# EAGLE design test_board (EAGLE 8.0.0)
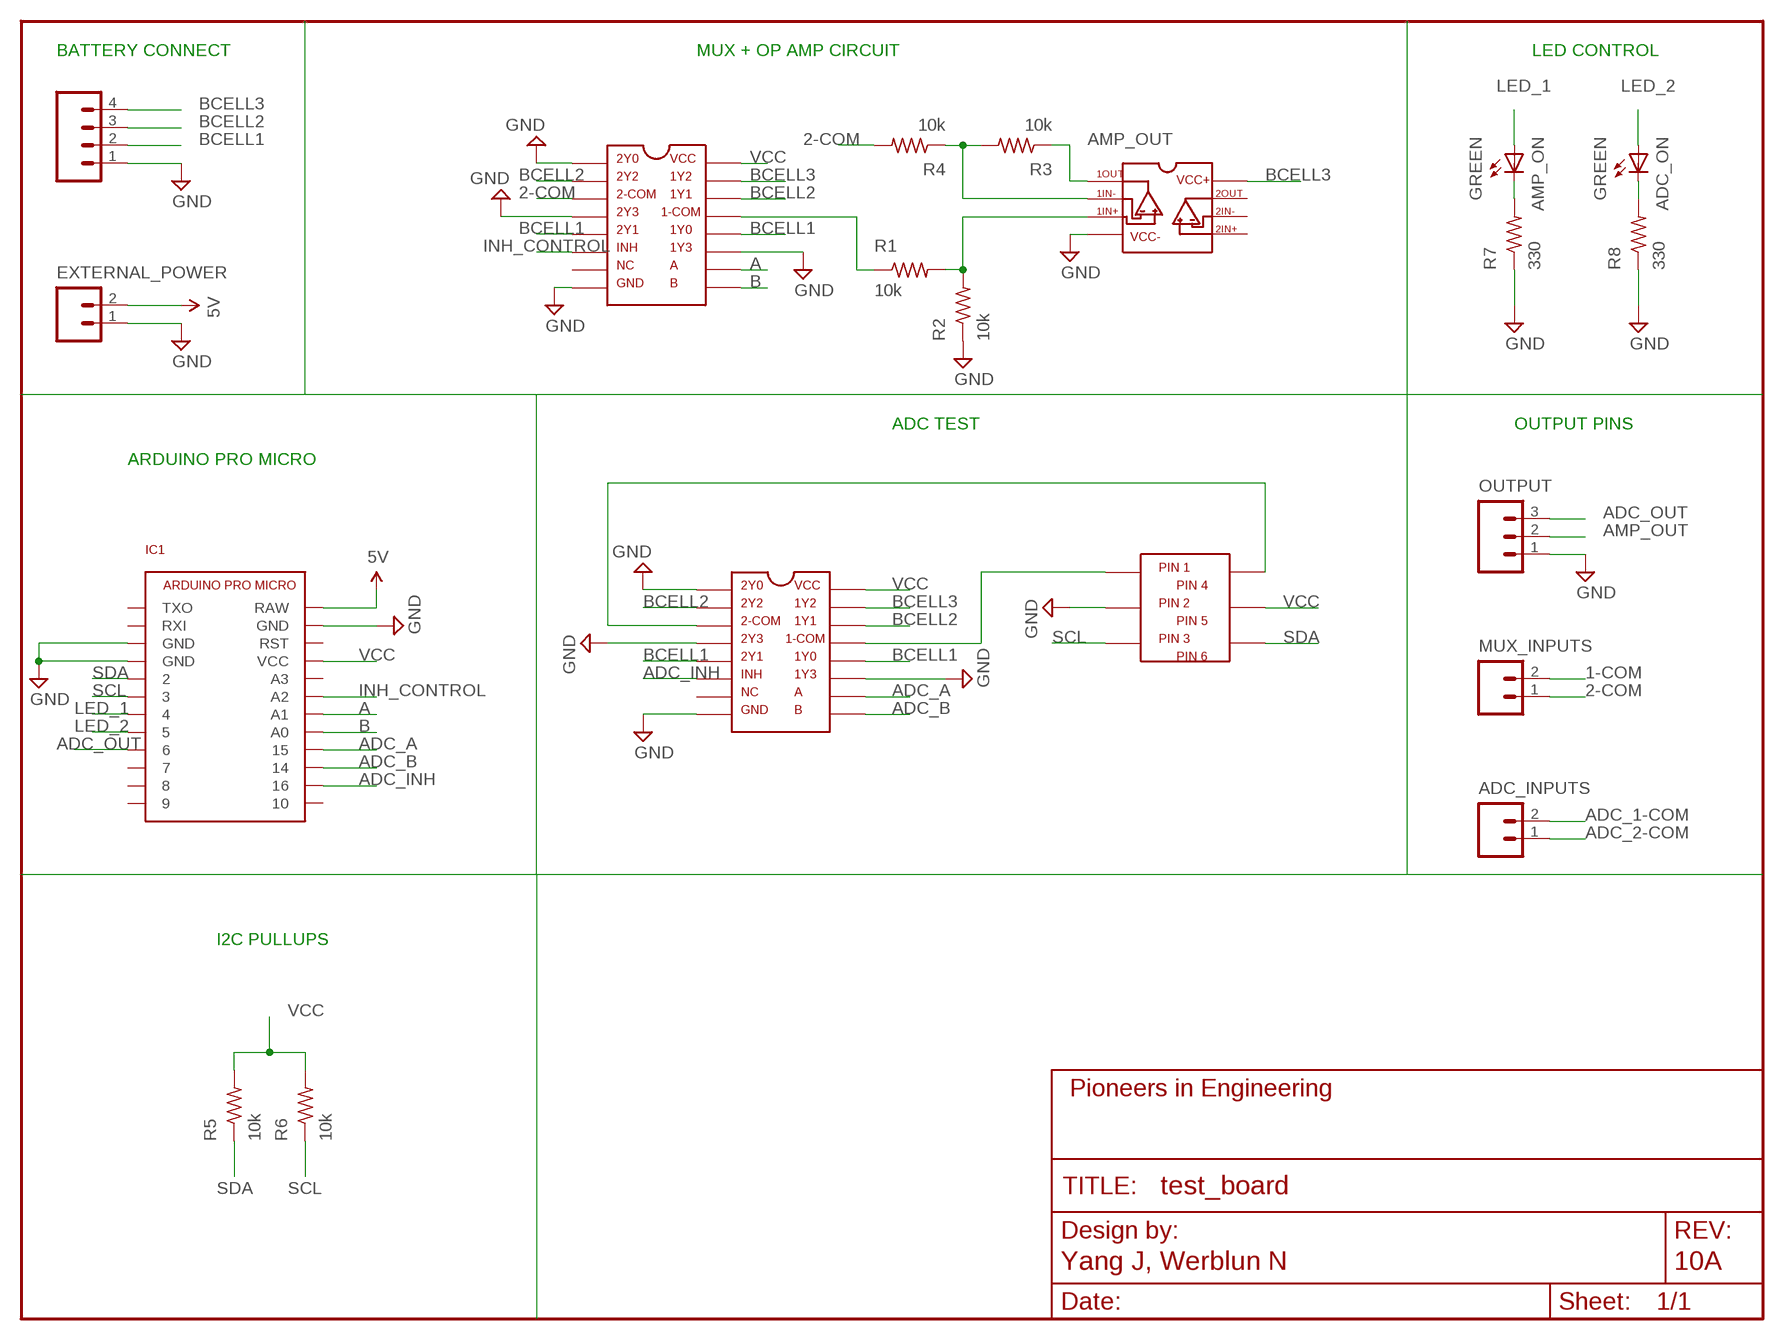
[diagram p0: schematic, sheet 1]
FRAME1 (FRAME_SCHEMATIC): AUTHOR: Yang J, Werblun N; REVISION: 10A

## Parts
ADC_INPUTS  M02PTH  [1X02]
ADC_ON  GREEN  LED0603  [LED-0603]
AMP_ON  GREEN  LED0603  [LED-0603]
BATTERY_CONNECT  XH_CONNECTOR_4POS  [XH_CONNECTOR_4POS_2.5MM]
EXTERNAL_POWER  M02PTH  [1X02]
IC1  ARDUINO_PRO_MICRO  [ARDUINO_PRO_MICRO]
MUX_INPUTS  M02PTH  [1X02]
OUTPUT  M03PTH  [1X03]
R1  10k  R-US_R0603  [R0603]
R2  10k  R-US_R0603  [R0603]
R3  10k  R-US_R0603  [R0603]
R4  10k  R-US_R0603  [R0603]
R5  10k  R-US_R0603  [R0603]
R6  10k  R-US_R0603  [R0603]
R7  330  R-US_R0603  [R0603]
R8  330  R-US_R0603  [R0603]
U$1  SN74HC4852  [DIL16]
U$2  TL072  [DIL08]
U$3  SOT-23_6PIN  [SOT-23_6PIN]
U$5  SN74HC4852  [DIL16]

## Nets
1-COM: MUX_INPUTS.2 R1.1 U$1.13(1-COM)
2-COM: MUX_INPUTS.1 R4.2 U$1.3(2-COM)
5V: EXTERNAL_POWER.2 IC1.RAW
A: IC1.A1 U$1.10(A)
ADC_1-COM: ADC_INPUTS.2 U$3.P$1 U$5.13(1-COM)
ADC_2-COM: ADC_INPUTS.1 U$3.P$4 U$5.3(2-COM)
ADC_A: IC1.15 U$5.10(A)
ADC_B: IC1.14 U$5.9(B)
ADC_INH: IC1.16 U$5.6(INH)
ADC_OUT: IC1.6 OUTPUT.3
AMP_OUT: OUTPUT.2 R3.1 U$2.1(1OUT)
B: IC1.A0 U$1.9(B)
BCELL1: BATTERY_CONNECT.2 U$1.5(2Y1) U$1.12(1Y0) U$5.5(2Y1) U$5.12(1Y0)
BCELL2: BATTERY_CONNECT.3 U$1.2(2Y2) U$1.14(1Y1) U$5.2(2Y2) U$5.14(1Y1)
BCELL3: BATTERY_CONNECT.4 U$1.15(1Y2) U$2.8(VCC+) U$5.15(1Y2)
GND: BATTERY_CONNECT.1 EXTERNAL_POWER.1 IC1.GND@0(GND) IC1.GND@1(GND) IC1.GND@2(GND) OUTPUT.1 R2.1 R7.1 R8.1 U$1.1(2Y0) U$1.4(2Y3) U$1.8(GND) U$1.11(1Y3) U$2.4(VCC-) U$3.P$2 U$5.1(2Y0) U$5.4(2Y3) U$5.8(GND) U$5.11(1Y3)
INH_CONTROL: IC1.A2 U$1.6(INH)
LED_1: AMP_ON.A IC1.4
LED_2: ADC_ON.A IC1.5
N$2: R1.2 R2.2 U$2.3(1IN+)
N$3: R3.2 R4.1 U$2.2(1IN-)
N$7: ADC_ON.C R8.2
N$8: AMP_ON.C R7.2
SCL: IC1.3 R6.1 U$3.P$3
SDA: IC1.2 R5.1 U$3.P$6
VCC: IC1.VCC R5.2 R6.2 U$1.16(VCC) U$3.P$5 U$5.16(VCC)
Unconnected: IC1.7 IC1.8 IC1.9 IC1.10 IC1.A3 IC1.RST IC1.RXI IC1.TXO U$1.7(NC) U$2.5(2IN+) U$2.6(2IN-) U$2.7(2OUT) U$5.7(NC)

## Notes on the sheet
- BATTERY CONNECT | MUX + OP AMP CIRCUIT | LED CONTROL
- ADC TEST | OUTPUT PINS
- ARDUINO PRO MICRO
- I2C PULLUPS

## Library data of the parts
ADC_INPUTS EXTERNAL_POWER MUX_INPUTS = pie:M02: 2-pin 0.1-inch header and MTA connector; PIE-INT-REF-NUM: BULK-STOCK
ADC_ON AMP_ON = pie:LED: LEDs Standard schematic elements and footprints for 5mm, 3mm, 1206, and 0603 sized LEDs. 5mm - Spark Fun Electronics SKU : COM-00529 (and others); DESCRIPTION: LEDs; DISTRIBUTOR: DigiKey; DISTRIBUTOR_PART_NUMBER: 160-1415-1-ND; MANUFACTURER: Lite-On Inc; MANUFACTURER_PART_NUMBER: LTST-C170KRKT; PACKAGE: LED0603; VALUE: COLOR
BATTERY_CONNECT = pie:XH_CONNECTOR_4POS: 4-pin XH connector (through-hole type shrouded header); PIE-INT-REF-NUM: XH-4POS; PIE_DIGIKEY-PN: 455-2249-ND
IC1 = pie:ARDUINO_PRO_MICRO: Arduino Pro Micro Electrical System Year 9's Smart Sensor Core Pin Outs <https://cdn.sparkfun.com/assets/9/c/3/c/4/523a1765757b7f5c6e8b4567.png> Buy Here <http://www.aliexpress.com/item/Mini-Leonardo-Pro-Micro-ATmega32U4-5V-16MHz-Module-For-Arduino-Best-Quality/32284746884.html?ws_ab_test=searchweb201556_8,searchweb201602_2_10057_10056_10065_10055_10054_10067_10069_10059_10058_10017_10070_10060_10061_10052_10062_10053_10050_10051,searchweb201603_1&btsid=45993952-29ca-4de4-a0fb-c7fb72b8e1a5> Thru Hole Female Pins <http://www.digikey.com/product-search/en?keywords=929974E-01-12-ND> Surface Mount Female Pins <http://www.digikey.com/product-detail/en/sullins-connector-solutions/NPTC121KFXC-RC/S5604-ND/776062>; DESCRIPTION: Arduino Pro Micro; DISTRIBUTOR: AliExpress; DISTRIBUTOR_PART_NUMBER: 32284746884; MANUFACTURER: Feiyang electronics; NOTES: https://www.aliexpress.com/item/Mini-Leonardo-Pro-Micro-ATmega32U4-5V-16MHz-Module-For-Arduino-Best-Quality/32284746884.html?ws_ab_test=searchweb201556_8,searchweb201602_2_10057_10056_10065_10055_10054_10067_10069_10059_10058_10017_10070_10060_10061_10052_10062_10053_10050_10051,searchweb201603_1&btsid=45993952-29ca-4de4-a0fb-c7fb72b8e1a5; PACKAGE: ARDUINO_PRO_MICRO; REFERENCE_DEST: ARDUINO_PRO_MICRO
OUTPUT = pie:M03: 3-pin 0.1-inch header and MTA connector; PIE-INT-REF-NUM: BULK-STOCK
R1-R8 = pie:R-US_: RESISTOR, American symbol; DESCRIPTION: RESISTOR, American symbol; DISTRIBUTOR: DigiKey; MANUFACTURER: Rohm Semiconductor; NOTES: Cut Tape; PACKAGE: R0603; VALUE: >VALUE
U$1 U$5 = pie:SN74HC4852
U$2 = pie:TL072
U$3 = pie:SOT-23_6PIN

## Board
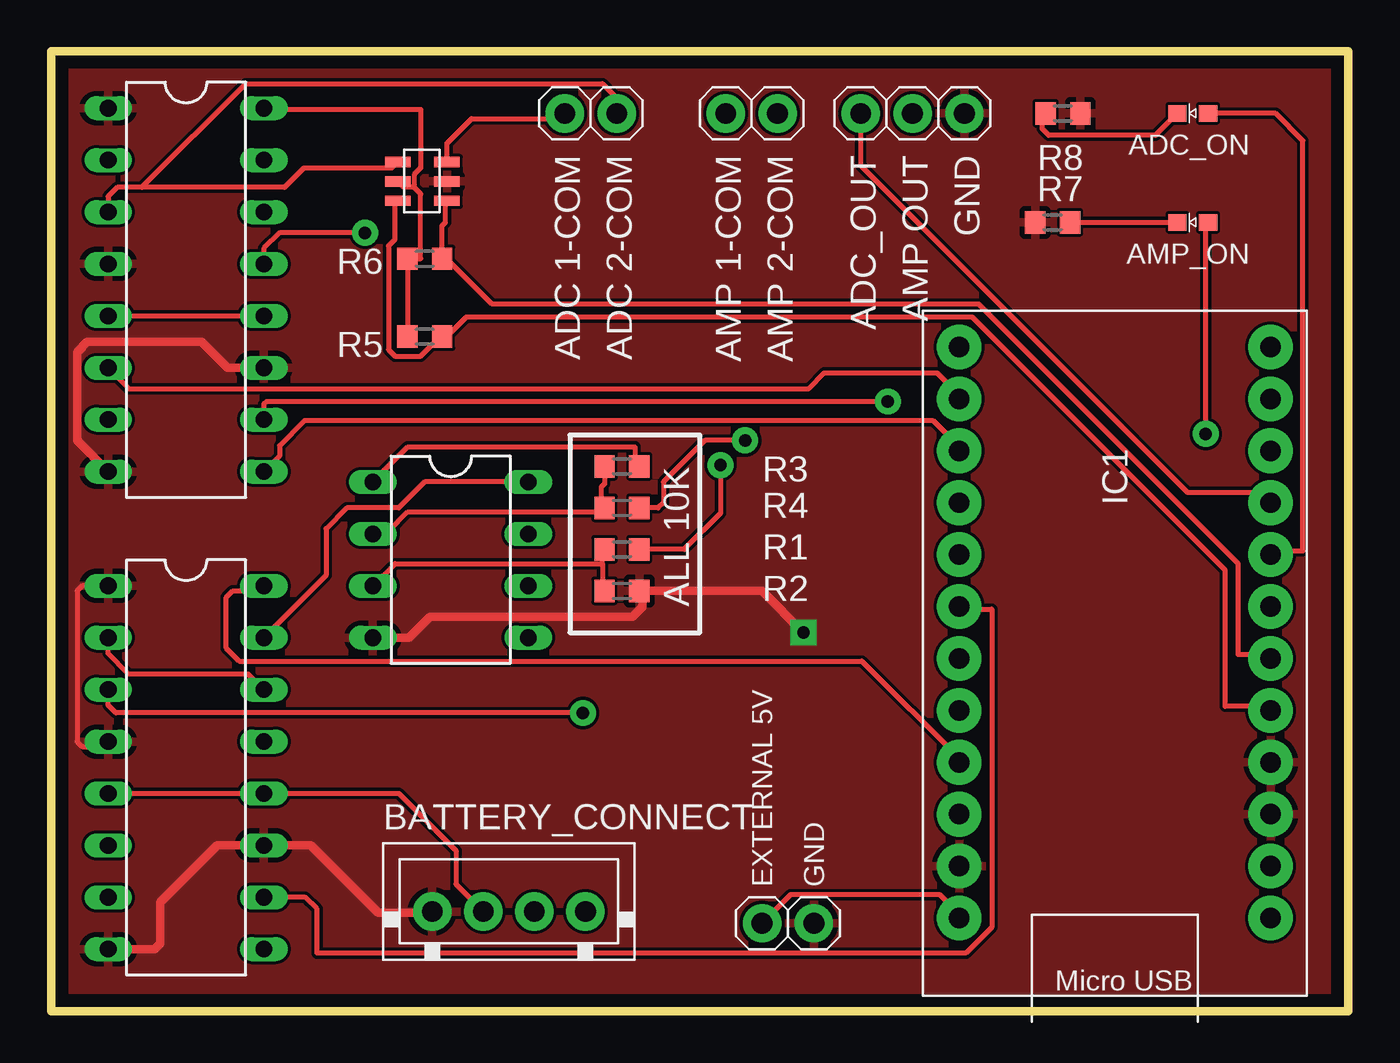
[diagram p1: board, top side]
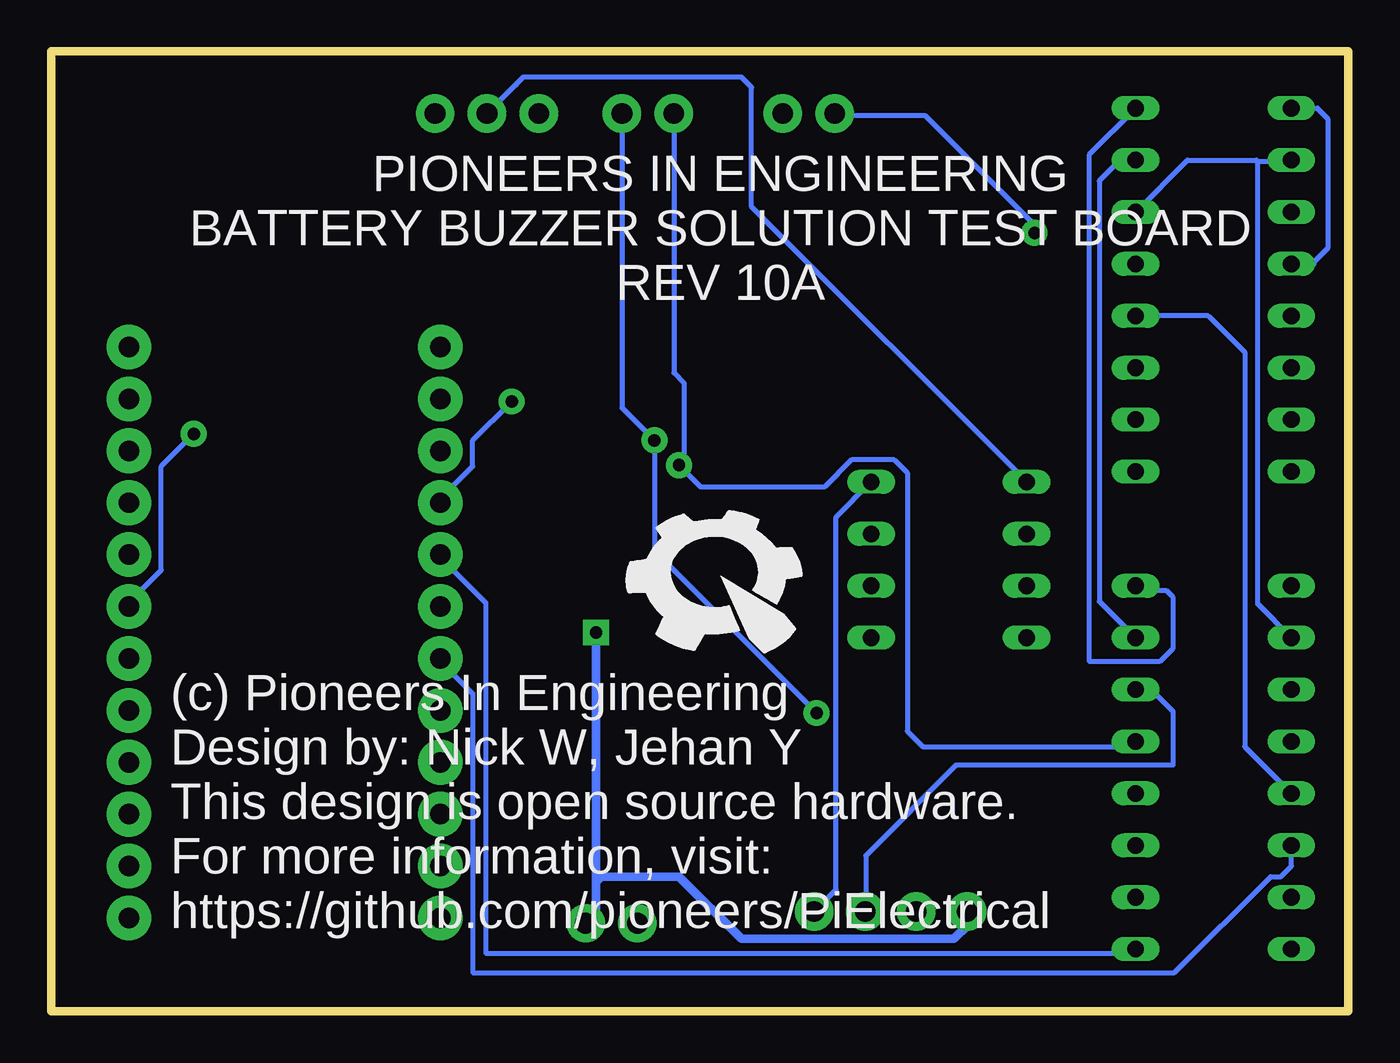
[diagram p2: board, bottom side, seen from below]

Size 63.5 x 46.99 mm. Coordinates in mm from the lower left corner, seen from the top.
Outline: 0,0 63.5,0 63.5,46.99 0,46.99 0,0
Copper layers (1*16): Top 2mil / dielectric 9mil / Bottom 2mil
Design rules "pie": minimum track width 6mil, minimum drill 15mil, track to track 6mil, track to pad 6mil, pad to pad 6mil, via to via 6mil, smd to smd 6mil, copper to edge 25mil, drill to drill 7mil, minimum pad ring 7mil, minimum via ring 7mil, stop-mask expansion 3mil, vias tented up to drill 21mil, thermal gap 10mil

### Footprints (pad centres in the part's own frame; a part is rotated, then mirrored left to right if it is on the bottom)
1X02 = drill 1.016 pad 1.88: 1 -1.27,0; 2 1.27,0
LED-0603 = smd 0.8 x 0.889: A 0,-0.75; C 0,0.75
XH_CONNECTOR_4POS_2.5MM = drill 1.016 pad 1.88: 1 -3.95,-0.19; 2 -1.45,-0.19; 3 1.05,-0.19; 4 3.55,-0.19
ARDUINO_PRO_MICRO = drill 1 pad 2.184: 2 1.778,19.558; 3 1.778,17.018; 4 1.778,14.478; 5 1.778,11.938; 6 1.778,9.398; 7 1.778,6.858; 8 1.778,4.318; 9 1.778,1.778; 10 17.018,1.778; 14 17.018,6.858; 15 17.018,9.398; 16 17.018,4.318; A0 17.018,11.938; A1 17.018,14.478; A2 17.018,17.018; A3 17.018,19.558; GND@0 1.778,24.638; GND@1 1.778,22.098; GND@2 17.018,27.178; RAW 17.018,29.718; RST 17.018,24.638; RXI 1.778,27.178; TXO 1.778,29.718; VCC 17.018,22.098
1X03 = drill 1.016 pad 1.88: 1 -2.54,0; 2 0,0; 3 2.54,0
R0603 = smd 1 x 1.1: 1 -0.85,0; 2 0.85,0
DIL16 = drill 0.813 long: 1 -8.89,-3.81; 2 -6.35,-3.81; 3 -3.81,-3.81; 4 -1.27,-3.81; 5 1.27,-3.81; 6 3.81,-3.81; 7 6.35,-3.81; 8 8.89,-3.81; 9 8.89,3.81; 10 6.35,3.81; 11 3.81,3.81; 12 1.27,3.81; 13 -1.27,3.81; 14 -3.81,3.81; 15 -6.35,3.81; 16 -8.89,3.81
DIL08 = drill 0.813 long: 1 -3.81,-3.81; 2 -1.27,-3.81; 3 1.27,-3.81; 4 3.81,-3.81; 5 3.81,3.81; 6 1.27,3.81; 7 -1.27,3.81; 8 -3.81,3.81
SOT-23_6PIN = smd 0.5 x 1.25: P$1 0.6,2.1; P$2 1.55,2.1; P$3 2.5,2.1; P$4 0.6,-0.3; P$5 1.55,-0.3; P$6 2.5,-0.3

### Placement (x,y rotation side)
ADC_INPUTS  26.42,43.94 180 top
ADC_ON  55.88,43.94 90 top
AMP_ON  55.88,38.61 90 top
BATTERY_CONNECT  22.61,5.08 0 top
EXTERNAL_POWER  36.07,4.32 180 top
IC1  61.47,34.29 180 top
MUX_INPUTS  34.29,43.94 180 top
OUTPUT  42.16,43.94 180 top
R1  27.94,22.61 180 top
R2  27.94,20.57 180 top
R3  27.94,26.67 180 top
R4  27.94,24.64 0 top
R5  18.29,33.02 180 top
R6  18.29,36.83 180 top
R7  49.02,38.61 0 top
R8  49.53,43.94 180 top
U$1  6.6,11.94 270 top
U$2  19.56,22.1 270 top
U$3  17.27,42.16 270 top
U$5  6.6,35.31 270 top
U$7  [PIE-LOGO-SMALL]  30.73,21.34 0 bottom

### Tracks (layer width: path | path; a pad name or v marks a point on that pad's centre or on a via)
1-COM  (via drill 0.61 pad 1.27)
  Top 0.254: v32.77,26.73 32.77,24.38 30.99,22.61 R1.1
  Bottom 0.254: MUX_INPUTS.2 33.02,31.24 32.51,30.73 32.51,26.99 v32.77,26.73 31.69,25.65 25.65,25.65 24.32,26.99 22.23,26.99 21.59,26.35 21.59,13.72 20.83,12.95 10.67,12.95 U$1.13
2-COM  (via drill 0.61 pad 1.27)
  Top 0.254: R4.2 29.72,24.64 29.97,24.89 29.97,25.91 32,27.94 v33.97,27.94 | U$1.3 2.79,14.99 3.17,14.61 v26.04,14.61
  Bottom 0.254: MUX_INPUTS.1 35.56,29.53 v33.97,27.94 33.97,22.54 v26.04,14.61
5V
  Top 0.254: EXTERNAL_POWER.2 36.2,5.71 43.5,5.71 44.45,4.76 IC1.RAW
A
  Top 0.254: IC1.A1 44.45,19.68 46.04,19.68 46.04,4.13 44.77,2.86 13.02,2.86 13.02,5.02 12.45,5.59 U$1.10
ADC_1-COM  (via drill 0.61 pad 1.27)
  Top 0.254: U$3.P$1 19.37,42.49 20.57,43.69 24.89,43.69 ADC_INPUTS.2 | U$5.13 10.41,37.34 11.18,38.1 v15.37,38.1
  Bottom 0.254: v15.37,38.1 15.49,38.23 15.49,38.61 20.7,43.81 25.02,43.81 ADC_INPUTS.2
ADC_2-COM
  Top 0.254: 4.45,40.32 11.43,40.32 12.38,41.27 16.68,41.27 U$3.P$4 | 4.45,40.32 9.53,45.4 26.99,45.4 27.69,44.7 ADC_INPUTS.1 | U$5.3 2.79,39.88 3.24,40.32 4.45,40.32
ADC_A  (via drill 0.61 pad 1.27)
  Top 0.254: v40.96,29.84 11.18,29.84 | 11.18,29.84 11.11,29.84 | 11.18,29.84 10.54,29.84 10.41,29.72 U$5.10
  Bottom 0.254: v40.96,29.84 42.86,27.94 42.86,26.67 44.45,25.08 IC1.15
ADC_B
  Top 0.254: IC1.14 44.45,27.62 43.18,28.89 12.38,28.89 11.18,27.69 11.18,27.18 U$5.9
ADC_INH
  Top 0.254: U$5.6 3.81,30.48 37.08,30.48 37.85,31.24 43.37,31.24 44.45,30.16 IC1.16
ADC_OUT
  Top 0.254: OUTPUT.3 39.62,41.4 55.63,25.4 59.18,25.4 IC1.6
AMP_OUT
  Top 0.254: U$2.1 17.46,27.62 28.57,27.62 28.57,26.67 R3.1
  Bottom 0.254: U$2.1 29.21,39.37 29.21,45.21 29.72,45.72 40.39,45.72 40.89,45.21 | 40.89,45.21 40.7,45.4 | 40.89,45.21 OUTPUT.2
B
  Bottom 0.254: IC1.A0 44.45,22.23 42.23,20 42.23,2.86 10.6,2.86 U$1.9
BCELL1
  Top 0.254: U$1.5 U$1.12 17.02,10.67 19.81,7.87 19.81,6.23 BATTERY_CONNECT.2 | U$5.5 U$5.12
  Bottom 0.254: U$5.12 6.86,34.04 5.08,32.26 5.08,12.95 U$1.5
BCELL2
  Top 0.254: U$1.14 9.65,16.51 3.81,16.51 2.79,17.53 U$1.2
  Bottom 0.254: U$5.2 2.86,41.59 4.45,41.59 | 4.45,41.59 4.45,19.94 U$1.2 | BATTERY_CONNECT.3 23.62,4.92 23.62,7.62 19.18,12.06 8.57,12.06 8.57,14.67 9.65,15.75 U$1.14 | 4.45,41.59 4.51,41.66 7.87,41.66 U$5.14
BCELL3
  Top 0.254: U$2.8 18.29,25.91 17.02,24.64 14.48,24.64 13.46,23.62 13.46,21.34 U$1.15
  Bottom 0.254: U$5.15 11.18,41.66 12.19,40.64 12.19,20.07 U$1.15 | BATTERY_CONNECT.4 25.08,5.96 25.08,24.19 U$2.8
GND  (via drill 0.6 pad 1.27)
  Top 0.254: U$1.1 1.52,20.83 1.27,20.57 1.27,13.21 1.52,12.95 2.54,12.95 U$1.4
  Top 0.406: U$5.11 8.64,31.5 7.37,32.77 1.78,32.77 1.27,32.26 1.27,27.94 U$5.8 | U$1.8 5.08,3.05 5.33,3.3 5.33,5.33 8.13,8.13 U$1.11 12.7,8.13 16,4.83 18.59,4.83 BATTERY_CONNECT.1 | U$2.4 17.53,18.29 18.54,19.3 28.45,19.3 28.96,19.81 28.96,20.41 R2.1 34.8,20.57 v36.83,18.54
  Bottom 0.254: U$5.1 1.52,44.2 1.02,43.69 1.02,37.34 1.78,36.58
  Bottom 0.406: 36.83,6.35 v36.83,18.54 | 36.83,6.35 36.83,4.83 EXTERNAL_POWER.1 | BATTERY_CONNECT.1 18.66,4.2 19.3,3.56 29.72,3.56 32.77,6.6 36.58,6.6 36.83,6.35 | 1.78,36.58 U$5.4
  pour Top: 0,46.99 63.5,46.99 63.5,0 0,0
INH_CONTROL
  Bottom 0.254: IC1.A2 44.45,17.14 42.86,15.56 42.86,1.91 8.51,1.91 3.81,6.6 3.3,6.6 2.79,7.11 U$1.6
LED_1  (via drill 0.61 pad 1.27)
  Top 0.254: AMP_ON.A 56.52,38.49 v56.52,28.26
  Bottom 0.254: v56.52,28.26 58.1,26.67 58.1,21.59 59.69,20 IC1.4
LED_2
  Top 0.254: IC1.5 59.69,22.54 61.28,22.54 61.28,42.61 59.94,43.94 ADC_ON.A
N$2
  Top 0.254: 26.99,21.91 16.83,21.91 U$2.3 | 26.99,21.91 26.99,20.68 R2.2 | 26.99,21.91 26.99,22.5 R1.2
N$3
  Top 0.254: 26.99,26.67 R3.2 27.09,25.82 26.92,25.65 26.92,24.8 R4.1 26.9,24.45 17.46,24.45 16.51,23.5 15.88,23.5 U$2.2
N$7
  Top 0.254: ADC_ON.C 54.05,42.86 48.83,42.86 48.51,43.18 48.51,43.78 R8.2
N$8
  Top 0.254: R7.2 AMP_ON.C
SCL
  Top 0.254: IC1.3 59.69,17.46 58.1,17.46 58.1,21.91 45.4,34.61 21.59,34.61 19.37,36.83 R6.1 19.14,38.44 19.3,38.61 19.3,39.6 U$3.P$3
SDA
  Top 0.254: IC1.2 59.69,14.92 57.47,14.92 57.47,21.59 45.09,33.97 20.32,33.97 19.37,33.02 R5.1 19.05,33.02 18.1,32.07 16.83,32.07 16.51,32.38 16.51,37.47 16.83,37.78 16.83,39.52 U$3.P$6
VCC
  Top 0.254: 17.46,36.83 17.46,33.02 R5.2 | 17.78,40.32 18.1,40.01 18.1,36.83 17.46,36.83 | 17.46,36.83 R6.2 | 17.78,40.32 17.78,40.96 18.1,41.27 18.1,44.13 10.48,44.13 U$5.16 | IC1.VCC 44.45,12.38 39.69,17.14 9.21,17.14 8.57,17.78 8.57,20.26 8.89,20.57 10.16,20.57 U$1.16 | U$3.P$5 17.26,40.32 17.78,40.32
  Bottom 0.254: U$5.16 12.7,41.91 12.7,17.14 9.21,17.14 8.57,17.78 8.57,20.26 8.89,20.57 10.16,20.57 U$1.16

### Text on the board
tPlace: ADC 1-COM | ADC 2-COM | AMP 1-COM | AMP 2-COM | ADC_OUT | AMP OUT | GND | ALL 10K | EXTERNAL 5V | GND
bPlace: PIONEERS IN ENGINEERING / BATTERY BUZZER SOLUTION TEST BOARD / REV 10A | (c) Pioneers In Engineering / Design by: Nick W, Jehan Y / This design is open source hardware. / For more information, visit: / https://github.com/pioneers/PiElectrical